# Altium schematic sheet Stepper Controller Schematic.SchDoc
size A2; SheetNumber: 1; SheetTotal: 1
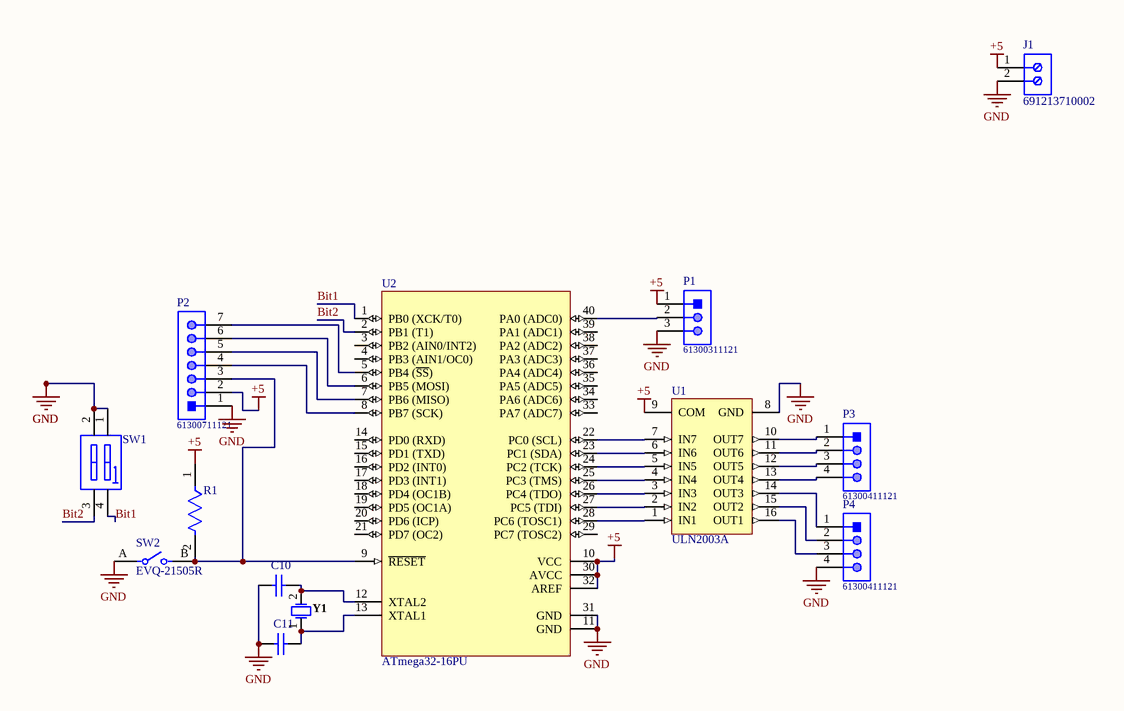
[diagram p0: Stepper Controller Schematic.SchDoc]

## Parts
C10  (no value)  [CAPR51-254-508X318X736]
C11  (no value)  [CAPR51-254-508X318X736]
J1  691213710002  [691213710002]
P1  61300311121  [61300311121]
P2  61300711121  [61300711121]
P3  61300411121  [61300411121]
P4  61300411121  [61300411121]
R1  (no value)  [FP-CF14-MFG]
SW1  (no value)  [418117270902]
SW2  EVQ-21505R  [FP-EVQ-21505R-MFG]
U1  ULN2003A  [STM-DIP-16L]
U2  ATmega32-16PU  [40P6]
Y1  (no value)  [FOX-FOXSLF160-20]

## Nets
+5: J1.1 P1.1 P2.2 R1.1 U1.9(COM) U2.10(VCC) U2.30(AVCC) U2.32(AREF)
GND: C10.1 C11.1 J1.2 P1.3 P2.1 P4.4 SW1.1 SW1.2 SW2.A U1.8(GND) U2.11(GND) U2.31(GND)
Bit1: SW1.4 U2.1(PB0_(XCK/T0))
Bit2: SW1.3 U2.2(PB1_(T1))
NetC10_2: C10.2 U2.12(XTAL2) Y1.2
NetC11_2: C11.2 U2.13(XTAL1) Y1.1
NetP1_2: P1.2 U2.40(PA0_(ADC0))
NetP2_3: P2.3 R1.2 SW2.B U2.9(~{RESET})
NetP2_4: P2.4 U2.8(PB7_(SCK))
NetP2_5: P2.5 U2.7(PB6_(MISO))
NetP2_6: P2.6 U2.6(PB5_(MOSI))
NetP2_7: P2.7 U2.5(PB4_(~{SS}))
NetP3_1: P3.1 U1.10(OUT7)
NetP3_2: P3.2 U1.11(OUT6)
NetP3_3: P3.3 U1.12(OUT5)
NetP3_4: P3.4 U1.13(OUT4)
NetP4_1: P4.1 U1.14(OUT3)
NetP4_2: P4.2 U1.15(OUT2)
NetP4_3: P4.3 U1.16(OUT1)
NetU1_1: U1.1(IN1) U2.28(PC6_(TOSC1))
NetU1_2: U1.2(IN2) U2.27(PC5_(TDI))
NetU1_3: U1.3(IN3) U2.26(PC4_(TDO))
NetU1_4: U1.4(IN4) U2.25(PC3_(TMS))
NetU1_5: U1.5(IN5) U2.24(PC2_(TCK))
NetU1_6: U1.6(IN6) U2.23(PC1_(SDA))
NetU1_7: U1.7(IN7) U2.22(PC0_(SCL))

Not connected (* = marked no-connect by the designer): U2 3(PB2_(AIN0/INT2)) 4(PB3_(AIN1/OC0)) 14(PD0_(RXD)) 15(PD1_(TXD)) 16(PD2_(INT0)) 17(PD3_(INT1)) 18(PD4_(OC1B)) 19(PD5_(OC1A)) 20(PD6_(ICP)) 21(PD7_(OC2)) 29(PC7_(TOSC2)) 33(PA7_(ADC7)) 34(PA6_(ADC6)) 35(PA5_(ADC5)) 36(PA4_(ADC4)) 37(PA3_(ADC3)) 38(PA2_(ADC2)) 39(PA1_(ADC1))

## Library data of the parts
C10 C11 = CMP-1664-00004-1: Radial Leaded Multilayer Ceramic Capacitor, 0.1 uF, +/- 10%, 50 V, -55 to 125 degC, 2-Pin THD, RoHS, Tape and Reel; Case\Package: SOT-23-5; Max Power Dissipation: 250 mW; Output Current: 150 mA; Dropout Voltage: 260 mV; Outputs: 1; Output Voltage: 5 V; Max Input Voltage: 8 V; Min Operating Temperature: -40 degC; Packaging: Tape and Reel; Height: 1.3 mm; Radiation Hardening: No; Pins: 5; ComponentLink1Description: Manufacturer URL; Mount: Surface Mount; RoHSCompliant: true; Max Operating Temperature: 85 degC; PackageReference: CAPR51-254-508X318X736; ComponentLink2URL: http://www.kemet.com/docfinder?Partnumber=C320C104K5R5TA; PackageDescription: 2-Pin Through Hole Device, Body 5.08 x 3.18 mm, Pitch 2.54 mm; ComponentLink1URL: http://www.kemet.com/; Width: 1.8 mm; Package Quantity: 3000; DatasheetVersion: Dec-15; Length: 3 mm; ComponentLink2Description: Datasheet
J1 = CMP-1502-02526-1: Serie 213 - 5.00 mm Horizontal Entry Modular with RisingCage Clamp WR-TBL, 2 pin; Manufacturer: Wurth Elektronik; Pin Number: 2; Pitch: 5.00mm; Packaging: Box; Datasheet URL: http://katalog.we-online.de/em/datasheet/6912137100xx.pdf; Mounting Technology: THT; Part Number: 691213710002; Operating Temperature: -40to105degC; Publisher: WurthElektronik; Manufacturer URL: http://www.we-online.de; Package Reference: 691213710002
P1 = CMP-1502-01062-1: THT Vertical Pin Header WR-PHD, Pitch 2.54 mm, Single Row, 3 pins; Manufacturer: Wurth Elektronik; Withstanding Voltage: 500VAC; Working Voltage: 250VAC; Rated Current: 3A; Pitch: 2.54mm; Pin Number: 3; Gender: Male; Contact Resistance: 20mOhm; Package Reference: 61300311121; Manufacturer URL: http://www.we-online.de; Datasheet URL: https://katalog.we-online.de/em/datasheet/6130xx11121.pdf; Operating Temperature: -40to105degC; Part Number: 61300311121; Orientation: Vertical; Packaging: Bag; Row Number: Single; Mounting Technology: THT; Publisher: WurthElektronik
P2 = CMP-1502-01074-1: THT Vertical Pin Header WR-PHD, Pitch 2.54 mm, Single Row, 7 pins; Manufacturer: Wurth Elektronik; Pin Number: 7; Gender: Male; Working Voltage: 250VAC; Contact Resistance: 20mOhm; Rated Current: 3A; Pitch: 2.54mm; Withstanding Voltage: 500VAC; Row Number: Single; Packaging: Bag; Orientation: Vertical; Manufacturer URL: http://www.we-online.de; Datasheet URL: https://katalog.we-online.de/em/datasheet/6130xx11121.pdf; Part Number: 61300711121; Publisher: WurthElektronik; Operating Temperature: -40to105degC; Mounting Technology: THT; Package Reference: 61300711121
P3 P4 = CMP-1502-01064-1: THT Vertical Pin Header WR-PHD, Pitch 2.54 mm, Single Row, 4 pins; Manufacturer: Wurth Elektronik; Withstanding Voltage: 500VAC; Rated Current: 3A; Working Voltage: 250VAC; Pin Number: 4; Gender: Male; Contact Resistance: 20mOhm; Pitch: 2.54mm; Manufacturer URL: http://www.we-online.de; Operating Temperature: -40to105degC; Packaging: Bag; Mounting Technology: THT; Package Reference: 61300411121; Datasheet URL: https://katalog.we-online.de/em/datasheet/6130xx11121.pdf; Publisher: WurthElektronik; Part Number: 61300411121; Row Number: Single; Orientation: Vertical
R1 = CMP-26528-000003-1: RES 7.5K OHM 1/4W 5% AXIAL; Max Power Dissipation: 250mW; Temperature Coefficient: -400ppm/°C; Resistance: 7.5kR; RoHS Compliant: Yes; Lead Free: Lead Free; Max Operating Temperature: 155°C; Case/Package: Axial; Tolerance: 5%; Power Rating: 250mW; Diameter: 2.3mm; Features: Flame Retardant Coating; Series: CF; Resistor Type: Carbon Film; Number of Terminations: 2; Length: 0.256inch; Min Operating Temperature: -55°C; Contact Plating: Tin; Packaging: Tape and Reel; Mount: Through Hole; Radiation Hardening: No
SW1 = CMP-1435-00002-1: WS-DITV 2.54 mm Compact THT Dip Switch with Raised Actuator; Manufacturer: Wuerth Elektronik; NoPins: 4; ComponentLink1Description: Manufacturer URL; PartNumber: 418117270902; ComponentLink2URL: http://katalog.we-online.de/em/datasheet/4181172709xx.pdf; PackageReference: 418117270902; ComponentLink2Description: Datasheet; ComponentLink1URL: http://www.we-online.com
SW2 = CMP-05618-000118-1: SWITCH TACTILE SPST-NO 0.02A 15V; Actuator Length: 1.6mm; Contact Current Rating: 20mA; Actuator Type: Standard; Operating Force: 1.6N; Switch Function: Off-Mom; Mechanical Life: 100000Cycles; Illumination Type: Non-Illuminated; Contact Resistance: 50mR; Actuator Color: Red; Throw Configuration: SPST; Switch Travel: 0.25mm; Termination: PC Pin; Package Quantity: 1; Lead Free: Lead Free; Orientation: Straight; Packaging: Tape and Reel; Series: EVQ2; Min Operating Temperature: -20°C; Max Operating Temperature: 70°C; Width: 6mm; Voltage Rating (DC): 15V; Current Rating: 20mA; Depth: 6mm; Height: 5mm; Contact Plating: Silver; Electrical Life: 100000Cycles; Mount: Through Hole; Max Voltage Rating (DC): 15V; Max Current Rating: 20mA; Length: 6mm; Size: 6mm; Case/Package: Radial
U1 = CMP-2000-07351-1: Seven Darlington Array, 50 V, 0.5 A, -40 to 85 degC, 16-Pin DIP, RoHS, Tube; Manufacturer: STMicroelectronics; Transistor Polarity: NPN; VOUT: 50V; No. of Pins: 16Pins; SVHC: NoSVHC(17-Dec-2015); DC Current Gain hFE: 1000hFE; Output Current: 0.5A; DC Collector Current: 500mA; Transistor Case Style: DIP; Package Reference: DIP-16L; Automotive Qualification Standard: -; Mounting Technology: ThroughHole; Power Dissipation Pd: -; Collector Emitter Voltage V(br)ceo: 50V; Datasheet URL: http://www2.st.com/content/ccc/resource/technical/document/datasheet/f3/6e/c8/64/4d/b3/4e/38/CD00001244.pdf/files/CD00001244.pdf/jcr:content/translations/en.CD00001244.pdf; Manufacturer URL: http://www.st.com/; PartNumber: ULN2003A; MSL: MSL2-1year; Product Range: -; Package Description: 16-Pin DIP, Body 19.7 x 7.1 mm, Pitch 2.54 mm; Operating Temperature Max: 85°C; Datasheet Version: Rev. 8, 06/2012
U2 = CMP-0095-00359-1: 8-bit AVR Microcontroller, 4.5-5.5V, 16MHz, 32KB Flash, 1024 Bytes EEPROM, 2KB SRAM, 40-pin PDIP, Industrial Grade (-40°C to 85°C); ComponentLink2Description: ATmega32(L) Datasheet; ComponentLink1Description: Manufacturer URL; ComponentLink2URL: http://atmel.com/dyn/resources/prod_documents/doc2503.pdf; Code_JEDEC: MS-011-AC; PackageVersion: revB, Sep-2001; ComponentLink3Description: ATmega32(L) Summary; ComponentLink3URL: http://atmel.com/dyn/resources/prod_documents/2503S.pdf; ComponentLink1URL: http://www.atmel.com/; PackageDescription: 40-lead (0.600"/15.24mm Wide) Plastic Dual Inline Package (PDIP); PackageReference: 40P6; DatasheetVersion: revQ, Feb-2011
Y1 = CMP-1749-00003-1: Resistance Weld Thru-Hole Crystal, 16 MHz, -20 to 70 degC, 2-Pin THD, RoHS, Bulk; Voltage Rating: 250 V; Tolerance: 1%; Resistance: 221 kohm; Case\Package: Axial; Power Rating: 250 mW; RoHSCompliant: true; Package Quantity: 200; Packaging: Bulk; Min Operating Temperature: -55 degC; DatasheetVersion: Mar-15; ComponentLink1URL: http://www.foxonline.com/; Max Operating Temperature: 155 degC; PackageReference: FOXSLF160-20; Mount: Through Hole; PackageDescription: 2-Pin Through Hole Device, Body 11.35 x 4.65 mm; ComponentLink1Description: Manufacturer URL; ComponentLink2URL: http://www.foxonline.com/pdfs/hc49slf.pdf; ComponentLink2Description: Datasheet; Length: 0.248 inch